# Altium schematic sheet nodemcu-tft144-radio.SchDoc
size A4
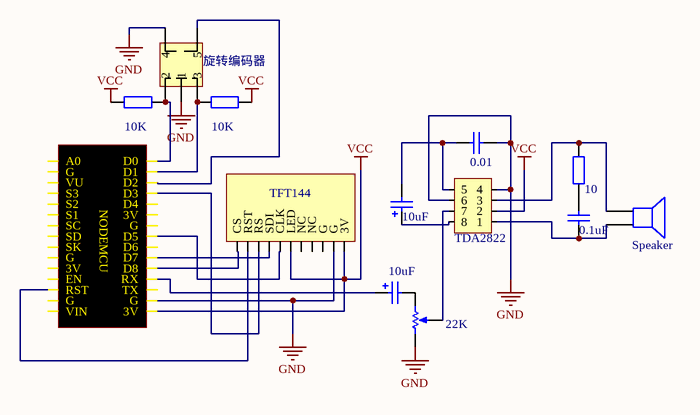
[diagram p0: nodemcu-tft144-radio.SchDoc]

## Parts
C1  value 10uF  [POLAR0.8]  (hidden comment: Cap Pol2)
C2  value 10uF  [POLAR0.8]  (hidden comment: Cap Pol2)
C3  value 0.01  [RAD-0.3]  (hidden comment: Cap)
C4  value 0.1uF  [RAD-0.3]  (hidden comment: Cap)
IC1  TDA2822
LS1  Speaker  [PIN2]
nodemcu  nodemcu  [NODEMCU]  (value not drawn)
R1  value 22K  [VR5]  (hidden comment: RPot)
R2  value 10  [AXIAL-0.4]  (hidden comment: Res2)
R6  value 10K  [AXIAL-0.4]  (hidden comment: Res2)
R7  value 10K  [AXIAL-0.4]  (hidden comment: Res2)
ro1  旋转编码器  [rotate_switch]
TFT144  TFT144  [TFT144]  (value not drawn)

## Nets
GND: C3.2 IC1.4 IC1.6 nodemcu.17(G) R1.1(TOP) ro1.1 ro1.4 TFT144.10(G)
VCC: IC1.2 nodemcu.16(3V) R6.2 R7.2 TFT144.6(LED) TFT144.11(3V)
NetC1_1: C1.1 nodemcu.19(RX)
NetC1_2: C1.2 R1.2(BOT)
NetC2_1: C2.1 IC1.8
NetC2_2: C2.2 C3.1 IC1.5
NetC4_1: C4.1 IC1.1 LS1.2
NetC4_2: C4.2 R2.1
NetIC1_3: IC1.3 LS1.1 R2.2
NetIC1_7: IC1.7 R1.3(TAP)
Netnodemcu_13: nodemcu.13(RST) TFT144.2(RST)
Netnodemcu_20: nodemcu.20(D8) TFT144.1(CS)
Netnodemcu_21: nodemcu.21(D7) TFT144.4(SDI)
Netnodemcu_23: nodemcu.23(D5) TFT144.5(CLK)
Netnodemcu_27: nodemcu.27(D3) TFT144.3(RS)
Netnodemcu_28: nodemcu.28(D2) ro1.5
Netnodemcu_29: nodemcu.29(D1) R7.1 ro1.3
Netnodemcu_30: nodemcu.30(D0) R6.1 ro1.2

Not connected (* = marked no-connect by the designer): nodemcu 1(A0) 2(G) 3(VU) 4(S3) 5(S2) 6(S1) 7(SC) 8(SD) 9(SK) 10(G) 11(3V) 12(EN) 14(G) 15(VIN) 18(TX) 22(D6) 24(G) 25(3V) 26(D4); TFT144 7(NC) 8(NC) 9(G)

## Notes on the sheet
- (in symbol nodemcu) NODEMCU

## Library data of the parts
C1 C2 = Cap Pol2: Polarized Capacitor (Axial); Published: 8-Jun-2000; LatestRevisionDate: 17-Jul-2002; LatestRevisionNote: Re-released for DXP Platform.; PackageReference: POLAR0.8; Publisher: Altium Limited
C3 C4 = Cap: Capacitor; Published: 8-Jun-2000; LatestRevisionDate: 17-Jul-2002; LatestRevisionNote: Re-released for DXP Platform.; PackageReference: RAD-0.3; Publisher: Altium Limited
LS1 = Speaker: Loudspeaker; Published: 24-Mar-1999; LatestRevisionDate: 17-Jul-2002; LatestRevisionNote: Re-released for DXP Platform.; PackageReference: PIN2; Publisher: Altium Limited
R1 = RPot: Potentiometer; Sim Note: Enter the Resistance value and the set point into parameter fields.; Set Position: 0.5; Published: 8-Jun-2000; LatestRevisionDate: 17-Jul-2002; LatestRevisionNote: Re-released for DXP Platform.; PackageReference: VR5; Publisher: Altium Limited
R2 R6 R7 = Res2: Resistor; Published: 8-Jun-2000; LatestRevisionDate: 17-Jul-2002; LatestRevisionNote: Re-released for DXP Platform.; PackageReference: AXIAL-0.4; Publisher: Altium Limited
ro1 = rotate_switch